# EAGLE design connector (EAGLE 5.11)
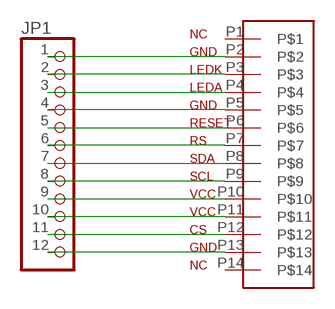
[diagram p0: schematic, sheet 1]

## Parts
JP1  PINHD-1X12  [1X12]
U$1  LCD_14_PIN_SERIAL  [LCD_SERIAL_CONNECTOR]

## Nets
N$1: JP1.1 U$1.P2
N$2: JP1.2 U$1.P3
N$3: JP1.3 U$1.P4
N$4: JP1.4 U$1.P5
N$5: JP1.5 U$1.P6
N$6: JP1.6 U$1.P7
N$7: JP1.7 U$1.P8
N$8: JP1.8 U$1.P9
N$9: JP1.9 U$1.P10
N$10: JP1.10 U$1.P11
N$11: JP1.11 U$1.P12
N$12: JP1.12 U$1.P13
Unconnected: U$1.P1 U$1.P14

## Library data of the parts
JP1 = pinhead:PINHD-1X12: PIN HEADER
U$1 = viduata:LCD_14_PIN_SERIAL

## Board
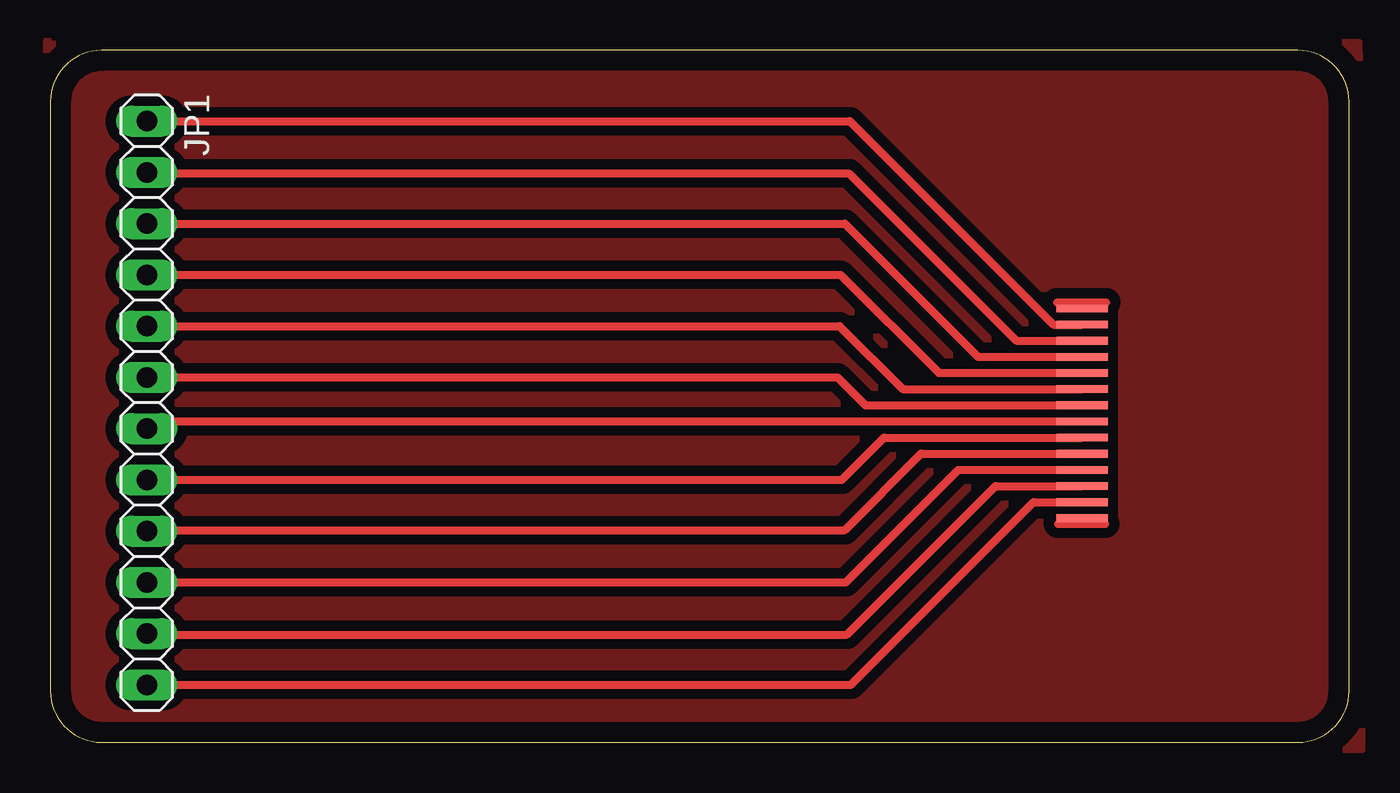
[diagram p1: board, top side]

Size 64.36 x 34.28 mm. Coordinates in mm from the lower left corner, seen from the top.
Outline: 2.54,34.28 arc90 0,31.74 0,2.54 arc90 2.54,0 61.82,0 arc90 64.36,2.54 64.36,31.74 arc90 61.82,34.28 2.54,34.28
Copper layers (1*16): Top 0.035mm / dielectric 1.5mm / Bottom 0.035mm
Design rules "default": minimum track width 10mil, minimum drill 24mil, track to track 8mil, track to pad 8mil, pad to pad 8mil, via to via 8mil, smd to smd 8mil, copper to edge 40mil, drill to drill 8mil, minimum pad ring 10mil, minimum via ring 8mil, stop-mask expansion 4mil, vias tented up to drill 0mil, thermal gap 10mil

### Footprints (pad centres in the part's own frame; a part is rotated, then mirrored left to right if it is on the bottom)
1X12 = drill 1.016 long: 1 -13.97,0; 2 -11.43,0; 3 -8.89,0; 4 -6.35,0; 5 -3.81,0; 6 -1.27,0; 7 1.27,0; 8 3.81,0; 9 6.35,0; 10 8.89,0; 11 11.43,0; 12 13.97,0
LCD_SERIAL_CONNECTOR = smd 2.54 x 0.381: P1 0,10.4; P2 0,9.6; P3 0,8.8; P4 0,8; P5 0,7.2; P6 0,6.4; P7 0,5.6; P8 0,4.8; P9 0,4; P10 0,3.2; P11 0,2.4; P12 0,1.6; P13 0,0.8; P14 0,0

### Placement (x,y rotation side)
JP1  4.78,16.81 270 top
U$1  51.13,11.1 0 top

### Tracks (layer width: path | path; a pad name or v marks a point on that pad's centre or on a via)
GND
  pour Top (isolate 0.508): -0.1,34.59 52.83,34.59 54.7,34.7 56.04,34.68 64.83,34.67 64.97,29.12 64.97,-0.36 53.54,-0.3 1.83,-0.3 -0.15,1.68 -0.15,34.8
N$1
  Top 0.406: U$1.P2 49.71,20.7 39.62,30.79 JP1.1
N$2
  Top 0.406: U$1.P3 47.87,19.9 39.57,28.19 4.83,28.19 JP1.2
N$3
  Top 0.406: U$1.P4 45.98,19.1 39.37,25.7 JP1.3
N$4
  Top 0.406: U$1.P5 44.03,18.3 39.17,23.16 JP1.4
N$5
  Top 0.406: U$1.P6 42.24,17.5 39.12,20.62 JP1.5
N$6
  Top 0.406: U$1.P7 40.4,16.7 39.01,18.09 JP1.6
N$7
  Top 0.406: U$1.P8 5.13,15.9 JP1.7
N$8
  Top 0.406: U$1.P9 41.31,15.1 39.22,13.01 JP1.8
N$9
  Top 0.406: U$1.P10 43.15,14.3 39.37,10.52 4.83,10.52 JP1.9
N$10
  Top 0.406: U$1.P11 45,13.5 39.42,7.92 JP1.10
N$11
  Top 0.406: U$1.P12 46.84,12.7 39.47,5.33 4.83,5.33 JP1.11
N$12
  Top 0.406: U$1.P13 48.73,11.9 39.67,2.85 JP1.12
N$13
  Top 0.406: 49.94,10.82 52.27,10.82
N$14
  Top 0.406: 49.89,21.79 52.32,21.79